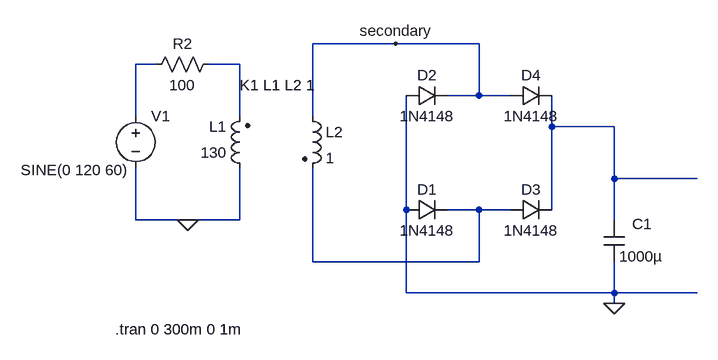
[diagram p0: schematic UnregulatedPowerSupply.asc]
UnregulatedPowerSupply.asc, the LTspice schematic file:
Version 4
SHEET 1 2948 1016
WIRE 384 16 256 16
WIRE 512 16 384 16
WIRE 16 48 -16 48
WIRE 144 48 96 48
WIRE 512 96 512 16
WIRE 512 96 464 96
WIRE 560 96 512 96
WIRE -16 128 -16 48
WIRE 144 128 144 48
WIRE 256 128 256 16
WIRE 624 144 624 96
WIRE 720 144 624 144
WIRE 720 224 720 144
WIRE 848 224 720 224
WIRE 400 272 400 96
WIRE 512 272 464 272
WIRE 560 272 512 272
WIRE 624 272 624 144
WIRE -16 288 -16 208
WIRE 64 288 -16 288
WIRE 144 288 144 208
WIRE 144 288 64 288
WIRE 720 288 720 224
WIRE 256 352 256 208
WIRE 512 352 512 272
WIRE 512 352 256 352
WIRE 400 400 400 272
WIRE 720 400 720 352
WIRE 720 400 400 400
WIRE 848 400 720 400
WIRE 720 416 720 400
FLAG 720 416 0
FLAG 384 16 secondary
FLAG 64 288 0
SYMBOL ind2 160 224 R180
WINDOW 0 36 80 Left 2
WINDOW 3 36 40 Left 2
SYMATTR InstName L1
SYMATTR Value 130
SYMATTR Type ind
SYMBOL ind2 240 112 R0
SYMATTR InstName L2
SYMATTR Type ind
SYMATTR Value 1
SYMBOL voltage -16 112 R0
WINDOW 123 0 0 Left 0
WINDOW 39 0 0 Left 0
WINDOW 3 -177 99 Left 2
SYMATTR Value SINE(0 120 60)
SYMATTR InstName V1
SYMBOL diode 400 288 R270
WINDOW 0 32 32 VTop 2
WINDOW 3 0 32 VBottom 2
SYMATTR InstName D1
SYMATTR Value 1N4148
SYMBOL diode 400 112 R270
WINDOW 0 32 32 VTop 2
WINDOW 3 0 32 VBottom 2
SYMATTR InstName D2
SYMATTR Value 1N4148
SYMBOL diode 560 288 R270
WINDOW 0 32 32 VTop 2
WINDOW 3 0 32 VBottom 2
SYMATTR InstName D3
SYMATTR Value 1N4148
SYMBOL diode 560 112 R270
WINDOW 0 32 32 VTop 2
WINDOW 3 0 32 VBottom 2
SYMATTR InstName D4
SYMATTR Value 1N4148
SYMBOL res 112 32 R90
WINDOW 0 0 56 VBottom 2
WINDOW 3 32 56 VTop 2
SYMATTR InstName R2
SYMATTR Value 100
SYMBOL cap 704 288 R0
WINDOW 0 44 6 Left 2
SYMATTR InstName C1
SYMATTR Value 1000µ
TEXT 144 80 Left 2 !K1 L1 L2 1
TEXT -48 456 Left 2 !.tran 0 300m 0 1m

The netlist it stands for:
* UnregulatedPowerSupply.asc
L1 0 N002 130
L2 secondary N004 1
V1 N001 0 SINE(0 120 60)
D1 0 N004 1N4148
D2 0 secondary 1N4148
D3 N004 N003 1N4148
D4 secondary N003 1N4148
R2 N002 N001 100
C1 N003 0 1000µ
.model D D
.lib standard.dio
K1 L1 L2 1
.tran 0 300m 0 1m
.backanno
.end